# EAGLE design 245_gas detection_Rev020000 (EAGLE 9.6.2)
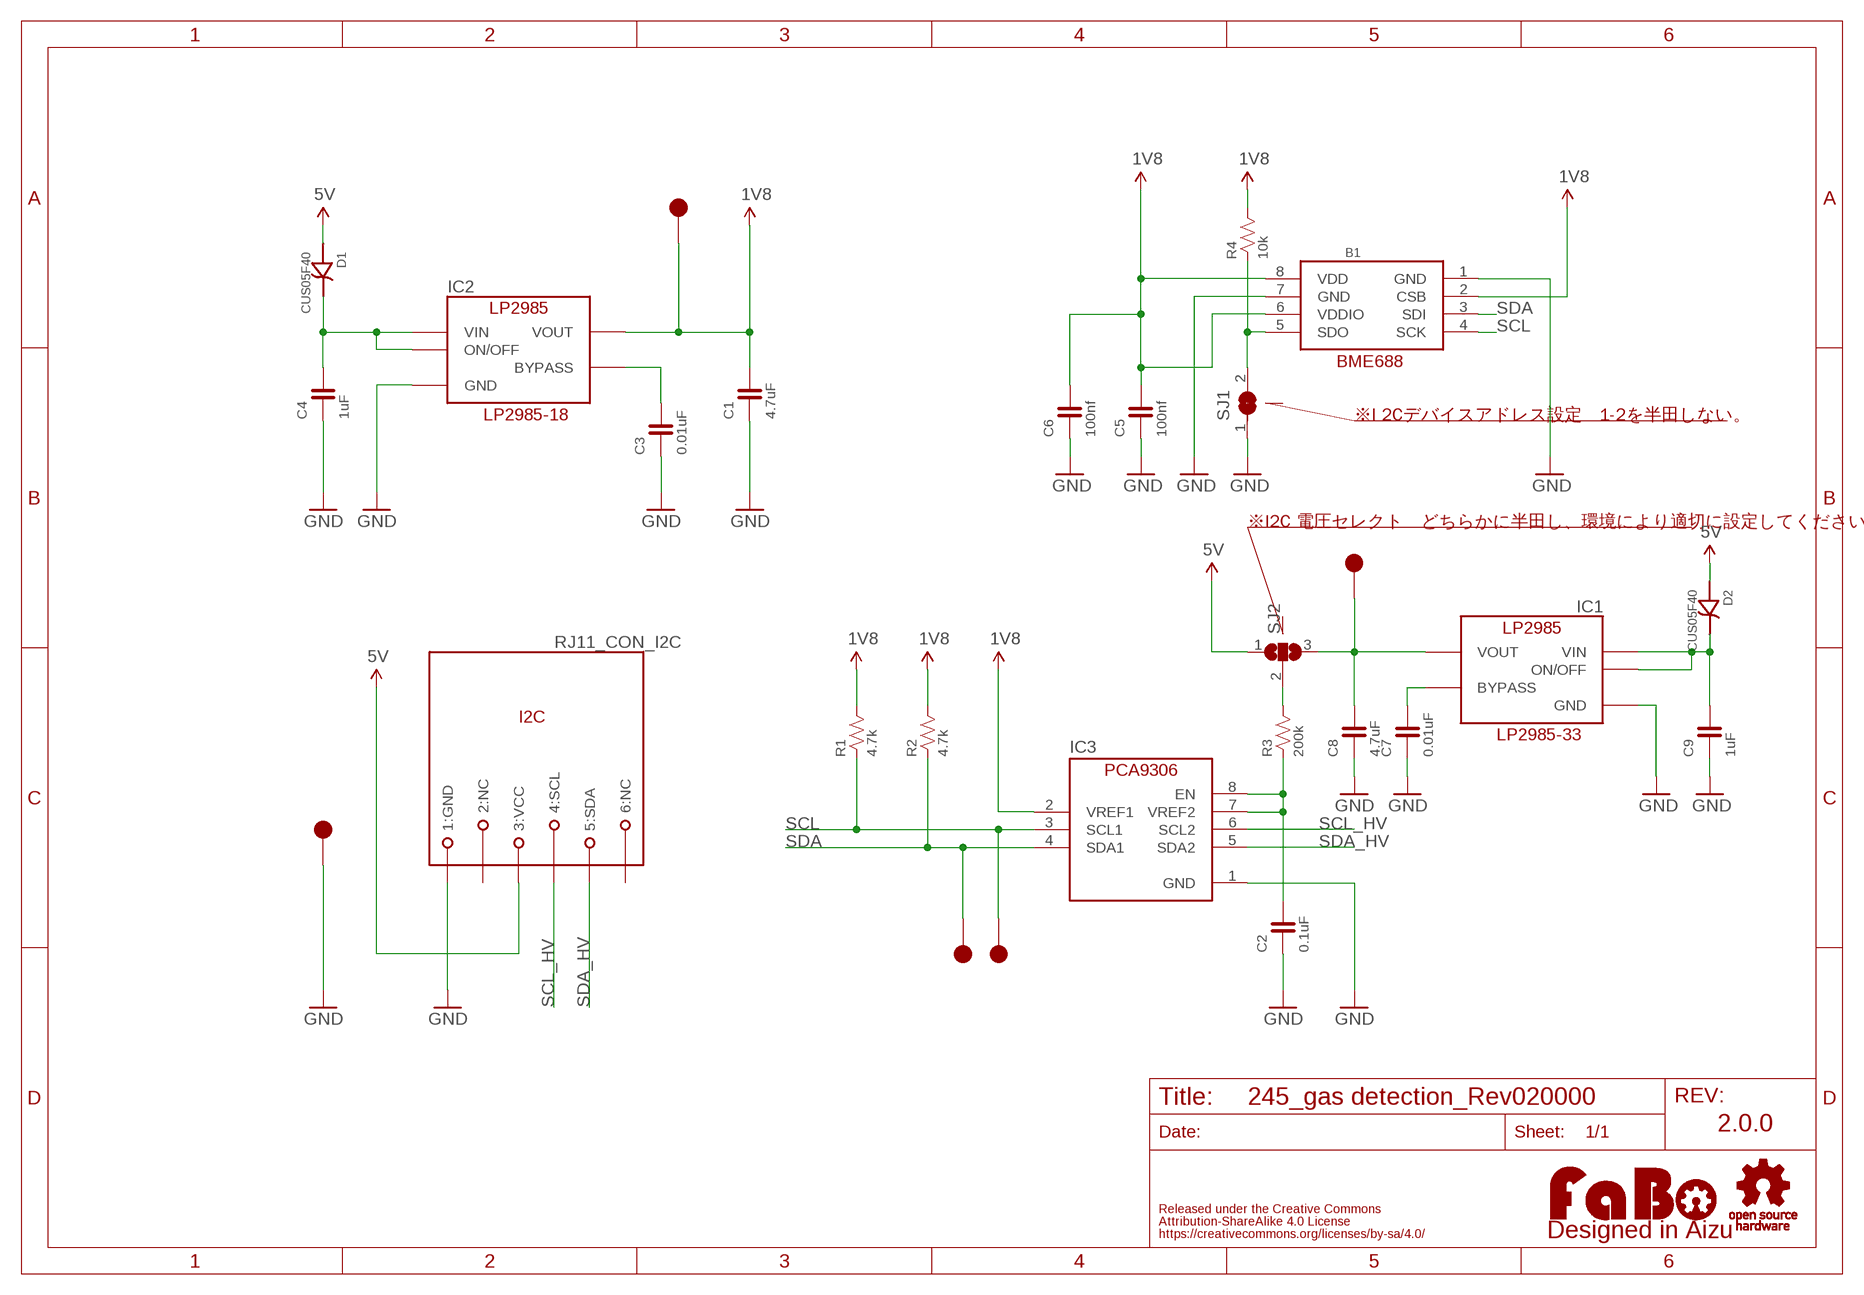
[diagram p0: schematic, sheet 1]

## Parts
B1  BO-BME680  [BOSCH-BME680]
C1  4.7uF  CAPACITOR-0603  [0603]
C2  0.1uF  CAPACITOR-0603  [0603]
C3  0.01uF  CAPACITOR-0603  [0603]
C4  1uF  CAPACITOR-0603  [0603]
C5  100nf  CAPACITOR-0603  [0603]
C6  100nf  CAPACITOR-0603  [0603]
C7  0.01uF  CAPACITOR-0603  [0603]
C8  4.7uF  CAPACITOR-0603  [0603]
C9  1uF  CAPACITOR-0603  [0603]
D1  CUS05F40  [CUS05F40]
D2  CUS05F40  [CUS05F40]
IC1  LP2985-33DBV  [SOT-23-5]
IC2  LP2985-33DBV  [SOT-23-5]
IC3  PCA9306_SSOP  [8PIN-SSOP]
LOGO1  LOGO_FABO-M  [LOGO_FABO_M]
R1  4.7k  RESISTOR-0603  [0603]
R2  4.7k  RESISTOR-0603  [0603]
R3  200k  RESISTOR-0603  [0603]
R4  10k  RESISTOR-0603  [0603]
RJ11_CON_I2C  MODULAR-JACK-6P-RJ11_I2C  [7002-6PXC-X]
SJ1  SJ  [SJ]
SJ2  SJ2W  [SJ_2]
TP1  TP-15  [TP-15]
TP2  TP-15  [TP-15]
TP3  TP-15  [TP-15]
TP4  TP-15  [TP-15]
TP5  TP-15  [TP-15]
U$2  LOGO_OSHW-M_BOTTOM  [LOGO_OSHW_M_BOTTOM]

## Nets
1V8: B1.2(CSB) B1.6(VDDIO) B1.8(VDD) C1.2 C5.2 C6.2 IC2.5(VOUT) IC3.2(VREF1) R1.2 R2.2 R4.2 TP3.1
3V3: C8.2 IC1.5(VOUT) SJ2.3 TP5.1
5V: D1.A(ANODE) D2.A(ANODE) RJ11_CON_I2C.3(3:VCC) SJ2.1
GND: B1.1(GND) B1.7(GND) C1.1 C2.1 C3.1 C4.1 C5.1 C6.1 C7.1 C8.1 C9.1 IC1.2(GND) IC2.2(GND) IC3.1(GND) RJ11_CON_I2C.1(1:GND) SJ1.1 TP4.1
N$1: C2.2 IC3.7(VREF2) IC3.8(EN) R3.1
N$2: B1.5(SDO) R4.1 SJ1.2
N$3: C3.2 IC2.4(BYPASS)
N$4: C4.2 D1.C(CATHODE) IC2.1(VIN) IC2.3(ON/OFF)
N$5: R3.2 SJ2.2
N$7: C7.2 IC1.4(BYPASS)
N$8: C9.2 D2.C(CATHODE) IC1.1(VIN) IC1.3(ON/OFF)
SCL: B1.4(SCK) IC3.3(SCL1) R1.1 TP2.1
SCL_HV: IC3.6(SCL2) RJ11_CON_I2C.4(4:SCL)
SDA: B1.3(SDI) IC3.4(SDA1) R2.1 TP1.1
SDA_HV: IC3.5(SDA2) RJ11_CON_I2C.5(5:SDA)
Unconnected: RJ11_CON_I2C.2(2:NC) RJ11_CON_I2C.6(6:NC)

## Notes on the sheet
- BME688
- LP2985-18 | ※I 2Cデバイスアドレス設定　1-2を半田しない。
- ※I2C 電圧セレクト　どちらかに半田し、環境により適切に設定してください。
- LP2985-33
- 2.0.0

## Library data of the parts
B1 = FaBo-Mems:BO-BME680
C1-C9 = FaBo-Capacitor:CAPACITOR: CAPACITOR
D1 D2 = FaBo-Diode:CUS05F40
IC1 IC2 = FaBo-Supply:LP2985: LP2985
IC3 = FaBo-LevelTranslator:PCA9306
LOGO1 = component:LOGO_FABO
R1-R4 = FaBo-Resistors:RESISTOR: RESISTOR
RJ11_CON_I2C = FaBo-Connetor:MODULAR-JACK-6P-RJ11_I2C
SJ1 = jumper:SJ: SMD solder JUMPER
SJ2 = jumper:SJ2W: SMD solder JUMPER
TP1-TP5 = FaBo-Supply:TP
U$2 = FaBo-etc:LOGO_OSHW

## Board
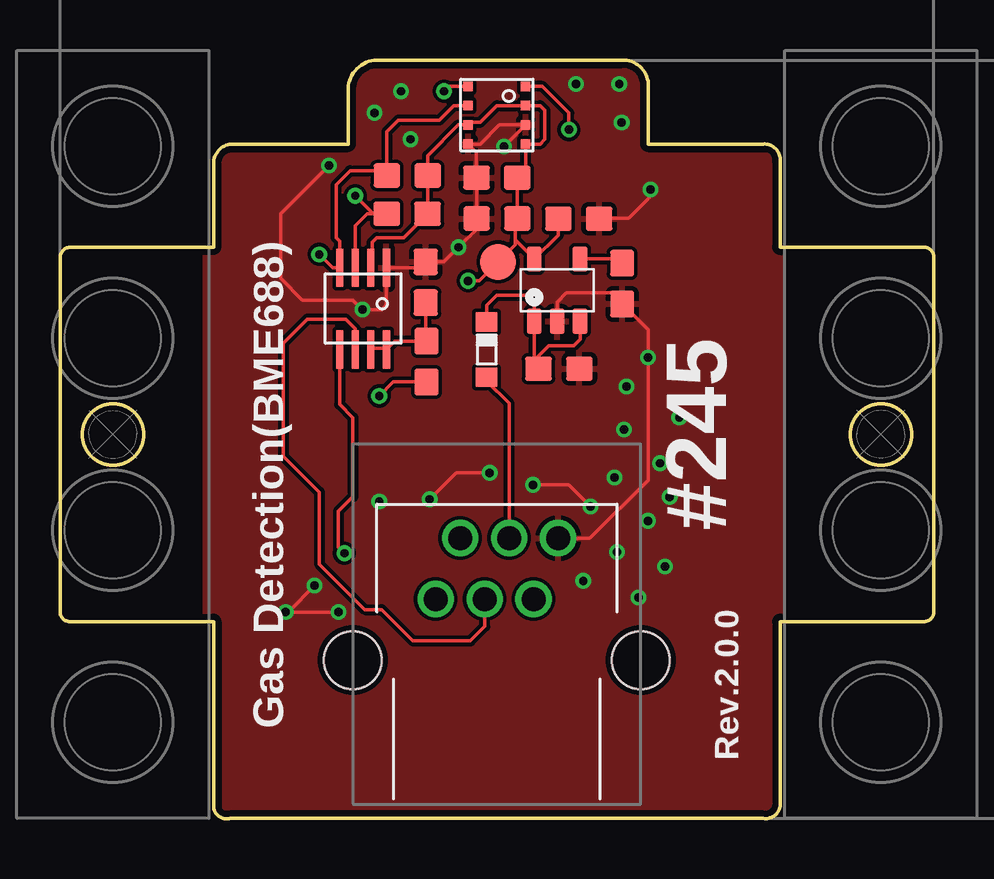
[diagram p1: board, top side]
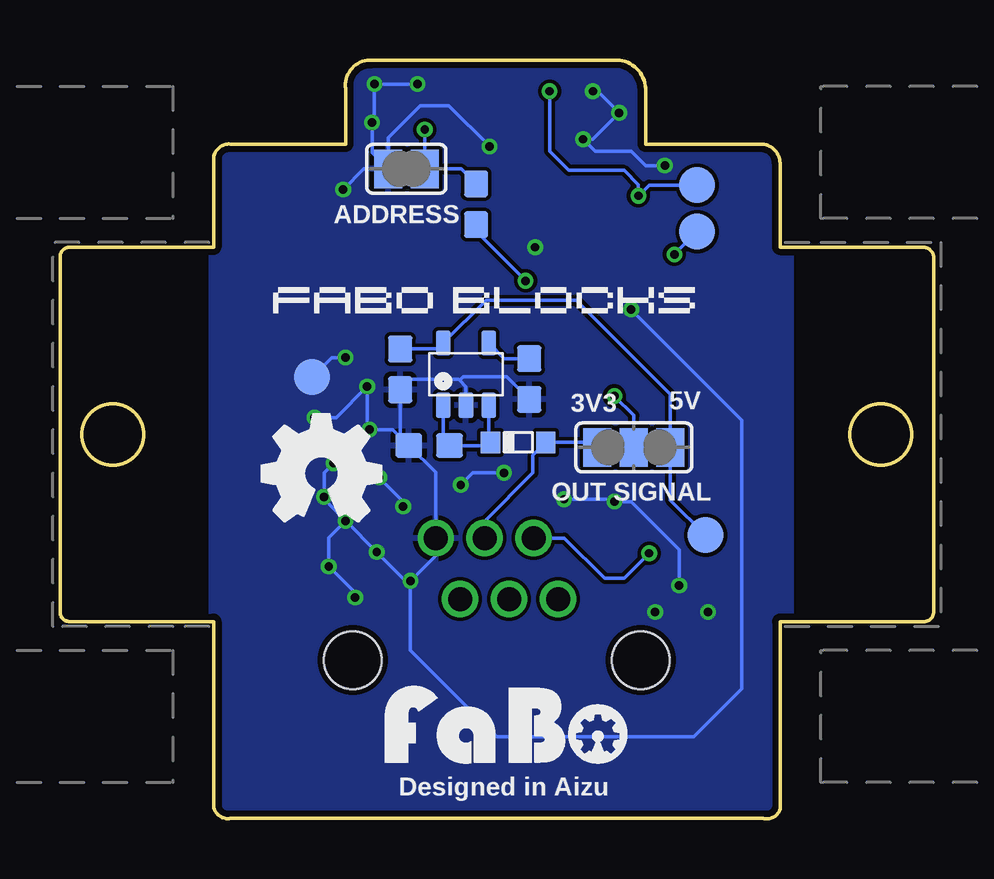
[diagram p2: board, bottom side, seen from below]

Size 36.4 x 31.62 mm. Coordinates in mm from the lower left corner, seen from the top.
Outline: 29.3,0.02 7.1,0.02 arc-90 6.4,0.42 6.4,8.22 0.4,8.22 arc-90 0,8.62 0,23.32 arc-90 0.4,23.82 6.4,23.82 6.4,27.32 arc-90 7.2,28.12 12,28.12 12,30.32 arc-90 13.2,31.62 23.4,31.62 arc-101 24.5,30.42 24.5,28.12 29.3,28.12 arc-99 30,27.42 30,23.82 36,23.82 arc-90 36.4,23.42 36.4,8.62 arc-90 36,8.22 30,8.22 30,0.52 arc-90 29.3,0.02
Outline: circle at 34.2,16.02 radius 1.27
Outline: circle at 2.2,16.02 radius 1.27
Copper layers (1*16): Top 0.035mm / dielectric 1.6mm / Bottom 0.035mm
Design rules "PCBway": minimum track width 6mil, minimum drill 12mil, track to track 6mil, track to pad 6mil, pad to pad 6mil, via to via 6mil, smd to smd 6mil, copper to edge 10mil, drill to drill 10mil, minimum pad ring 10mil, minimum via ring 6mil, stop-mask expansion 2mil, vias tented up to drill 100mil, thermal gap 8mil

### Footprints (pad centres in the part's own frame; a part is rotated, then mirrored left to right if it is on the bottom)
BOSCH-BME680 = smd 0.4 x 0.4: 1 -1.2,1.2; 2 -0.4,1.2; 3 0.4,1.2; 4 1.2,1.2; 5 1.2,-1.2; 6 0.4,-1.2; 7 -0.4,-1.2; 8 -1.2,-1.2
0603 = smd 1.1 x 1: 1 -0.85,0; 2 0.85,0
CUS05F40 = smd 0.8 x 0.9: A -1.15,0; C 1.15,0
SOT-23-5 = smd 0.6 x 1.05: 1 -0.95,-1.3; 2 0,-1.3; 3 0.95,-1.3; 4 0.95,1.3; 5 -0.95,1.3
8PIN-SSOP = smd 0.3 x 1.6: 1 -0.975,-1.7; 2 -0.325,-1.7; 3 0.325,-1.7; 4 0.975,-1.7; 5 0.975,1.7; 6 0.325,1.7; 7 -0.325,1.7; 8 -0.975,1.7
7002-6PXC-X = drill 1: 1 2.55,5.08; 2 1.53,2.54; 3 0.51,5.08; 4 -0.51,2.54; 5 -1.53,5.08; 6 -2.55,2.54 | hole 2.4: -6,0; 6,0
SJ = smd 1.168 x 1.6: 1 -0.762,0; 2 0.762,0
SJ_2 = smd 1.168 x 1.6: 1 -1.524,0; 2 0,0; 3 1.524,0
TP-15 = smd 1.5 x 1.5: 1 0,0

### Placement (x,y rotation side)
B1  18.2,29.32 90 top
C1  21.61,25.01 180 top
C2  15.24,22.36 270 top
C3  23.42,22.31 90 top
C4  20.79,18.76 180 top
C5  18.2,26.72 0 top
C6  18.21,25.02 0 top
C7  16.85,18.33 90 bottom
C8  22.23,18.73 90 bottom
C9  21.02,15.56 0 bottom
D1  17.78,19.56 90 top
D2  17.31,15.69 180 bottom
IC1  19.49,18.53 0 bottom
IC2  20.72,22.03 0 top
IC3  12.63,21.27 180 top
LOGO1  17.8,1.93 0 bottom
R1  14.46,25.21 0 top
R2  14.47,26.81 0 top
R3  15.27,19.06 270 top
R4  19.06,25.61 270 bottom
RJ11_CON_I2C  18.2,6.62 0 top
SJ1  21.97,27.09 0 bottom
SJ2  12.49,15.48 0 bottom
TP1  9.85,24.47 0 bottom
TP2  9.85,26.41 0 bottom
TP3  18.26,23.21 0 top
TP4  25.9,18.41 0 bottom
TP5  9.5,11.82 0 bottom
U$2  25.5,14.4 0 top
U$3  [4-1BLOCK]  2.2,16.02 0 top
U$4  [4-1BLOCK]  34.2,16.02 180 top

### Tracks (layer width: path | path; a pad name or v marks a point on that pad's centre or on a via)
1V8  (via drill 0.35)
  Top 0.152: C1.2 20.76,24.33 IC2.5 18.97,24.13 | 18.97,24.13 18.97,24.93 C6.2 C5.2 19.4,27.07 B1.8 20,28.12 20.2,28.32 20.2,29.52 20,29.72 B1.6 18.2,29.72 17.5,29.02 17.1,29.02 B1.2 16.6,28.92 15.32,27.64 R2.2 R1.2 14.32,24.22 13.2,24.22 13,24.02 13,23.02 IC3.2 | 18.97,24.13 18.97,23.92 TP3.1 17.47,22.42 v17,22.42
  Bottom 0.152: R4.2 19.06,24.48 v17,22.42
3V3
  Bottom 0.152: C8.2 20.69,19.58 IC1.5 18.65,21.62 14.9,21.62 10.97,17.69 SJ2.3 10.97,13.29 TP5.1
5V
  Top 0.152: RJ11_CON_I2C.3 18.71,17.31 17.78,18.25 D1.A
  Bottom 0.152: SJ2.1 14.23,15.69 D2.A 16.7,15.15 16.7,14.42 18.71,12.41 RJ11_CON_I2C.3
GND  (via drill 0.35)
  Top 0.152: IC2.2 20.72,21.54 21.1,21.92 22.96,21.92 C3.1 24.5,20.38 v24.5,19.22 24.5,14.12 22.08,11.7 RJ11_CON_I2C.1 | C1.1 22.48,25.02 23.7,25.02 24.6,25.92 v24.6,26.22 | v18.5,28.02 B1.7 18.3,28.92 17.5,28.12 B1.1 17.35,27.77 C5.1 C6.1 17.36,24.58 v16.6,23.82 15.99,23.21 C2.1 14.99,22.97 IC3.1 13.6,21.42 13.4,21.22 v12.6,21.22 12.2,21.62 10.1,21.62 9.2,22.52 9.2,25.22 v11.2,27.22 | v11.6,8.62 v9.4,8.62 9.5,8.62 v10.6,9.72 | v19.7,13.92 21.2,13.92 v22.1,13.02 | v15.4,13.32 16.5,14.42 v17.9,14.42
  Bottom 0.152: IC1.2 19.49,18.01 19.75,18.27 | 19.75,18.27 19.8,18.32 21.79,18.32 C8.1 22.23,15.91 C9.1 | C7.1 17.79,18.42 19.6,18.42 19.75,18.27 | C9.1 20.75,14.44 RJ11_CON_I2C.1 20.75,10.97 21.75,9.97 | v24.5,19.22 25.09,19.22 TP4.1 | v24.6,26.22 23.74,27.09 SJ1.1 | v12.6,21.22 8,16.62 8,5.42 10,3.42 18.2,3.42 21.8,7.02 v21.8,9.92 21.75,9.97 | v18.5,28.02 20.2,29.72 21.4,29.72 22.73,28.39 SJ1.1 | v14.2,30.32 14,30.32 v13.1,29.42 14.2,28.32 v14.6,28.32 14.1,27.82 12.6,27.82 12,27.22 v11.2,27.22 | v21.5,30.62 v23.3,30.62 23.3,29.12 v23.4,29.02 23.4,27.75 SJ1.1 | v10.6,9.72 10.6,11.22 12.6,13.22 v13.3,13.22 13.4,13.32 v15.4,13.32 | v24.1,9.22 24.1,9.42 v25.2,10.52 25.2,11.72 v24.5,12.42 | v24.5,12.42 v23.2,11.12 22.05,9.97 21.75,9.97 | v24.5,12.42 25.4,13.32 v25.4,13.42 25.4,14.42 v25,14.82 24.4,14.22 v23.1,14.22 22.1,13.22 v22.1,13.02 | v17.9,14.42 19.2,14.42 v19.7,13.92 | C9.1 22.54,16.22 v23.5,16.22 23.6,16.32 v23.6,18.02 24.9,16.72 v25.8,16.72
  pour Bottom (isolate 0.152): 5.9,0.02 30.14,0.02 30.14,33.09 5.9,33.09
  pour Top (isolate 0.152): 6,0.02 30.14,0.02 30.14,32.69 6,32.69
N$1
  Top 0.152: 13.66,19.62 13.94,19.91 R3.1 15.24,19.94 C2.2 | 13.66,19.62 IC3.8 | IC3.7 12.95,19.62 13.66,19.62
N$2  (via drill 0.35)
  Top 0.152: v21.2,28.72 21.2,29.42 20.1,30.52 B1.5
  Bottom 0.152: v21.2,28.72 SJ1.2 19.69,27.09 R4.1
N$3
  Top 0.152: IC2.4 23.25,23.33 C3.2
N$4
  Top 0.152: D1.C 17.78,21.41 18.19,21.82 19.4,21.82 19.77,21.46 IC2.1 19.77,19.12 | C4.2 19.77,18.93 19.77,19.12 | IC2.3 21.67,19.99 21.4,19.72 20.37,19.72 19.77,19.12
N$5  (via drill 0.35)
  Top 0.152: v13.3,17.62 13.89,18.21 R3.2
  Bottom 0.152: SJ2.2 12.49,16.81 v13.3,17.62
N$7
  Bottom 0.152: IC1.4 17.89,19.18 C7.2
N$8
  Bottom 0.152: IC1.1 20.44,15.82 C9.2 18.7,15.56 | 18.7,15.56 18.6,15.56 D2.C | IC1.3 18.54,15.72 18.7,15.56
SCL  (via drill 0.35)
  Top 0.152: IC3.3 12.3,24.72 12.79,25.21 R1.1 13.06,25.21 v12.3,25.97 | v16,30.32 16.2,30.52 B1.4
  Bottom 0.152: TP2.1 11.86,26.41 v12.3,25.97 12.3,26.42 12.9,27.02 15.2,27.02 16,27.82 v16,30.32
SCL_HV
  Top 0.152: IC3.6 12.3,20.42 11.9,20.82 10.3,20.82 9.3,19.82 9.3,15.12 10.8,13.62 10.8,10.62 12.7,8.72 13.4,8.72 14.7,7.42 17.1,7.42 17.7,8.02 RJ11_CON_I2C.4
SDA  (via drill 0.35)
  Top 0.152: R2.1 13.42,27.01 12.09,27.01 11.5,26.42 11.5,24.22 11.65,24.07 IC3.4 11.36,22.97 v10.8,23.52 | R2.1 13.62,26.84 | R2.1 13.62,28.64 14.1,29.12 15.8,29.12 16.4,29.72 B1.3
  Bottom 0.152: TP1.1 v10.8,23.52
SDA_HV  (via drill 0.35)
  Top 0.152: IC3.5 11.65,17.27 12.2,16.72 12.2,13.42 11.6,12.82 11.6,11.32 v11.85,11.07
  Bottom 0.152: v11.85,11.07 12.9,10.02 13.7,10.02 15.38,11.7 RJ11_CON_I2C.5

### Text on the board
tPlace: #245 | Gas Detection(BME688) | Rev.2.0.0
bPlace: ADDRESS | 5V | 3V3 | OUT SIGNAL | Designed in Aizu
Document: 245 Gas Detection_BME688 Rev2.0.0 / 2022/06/07 | Note / To inspect the voltage
tDocu: BME688 | LP2985-18
bDocu: LP2985-33